# Altium schematic sheet Buck_60W20V_Overview.SchDoc
size A4; SheetNumber: 1; SheetTotal: 7
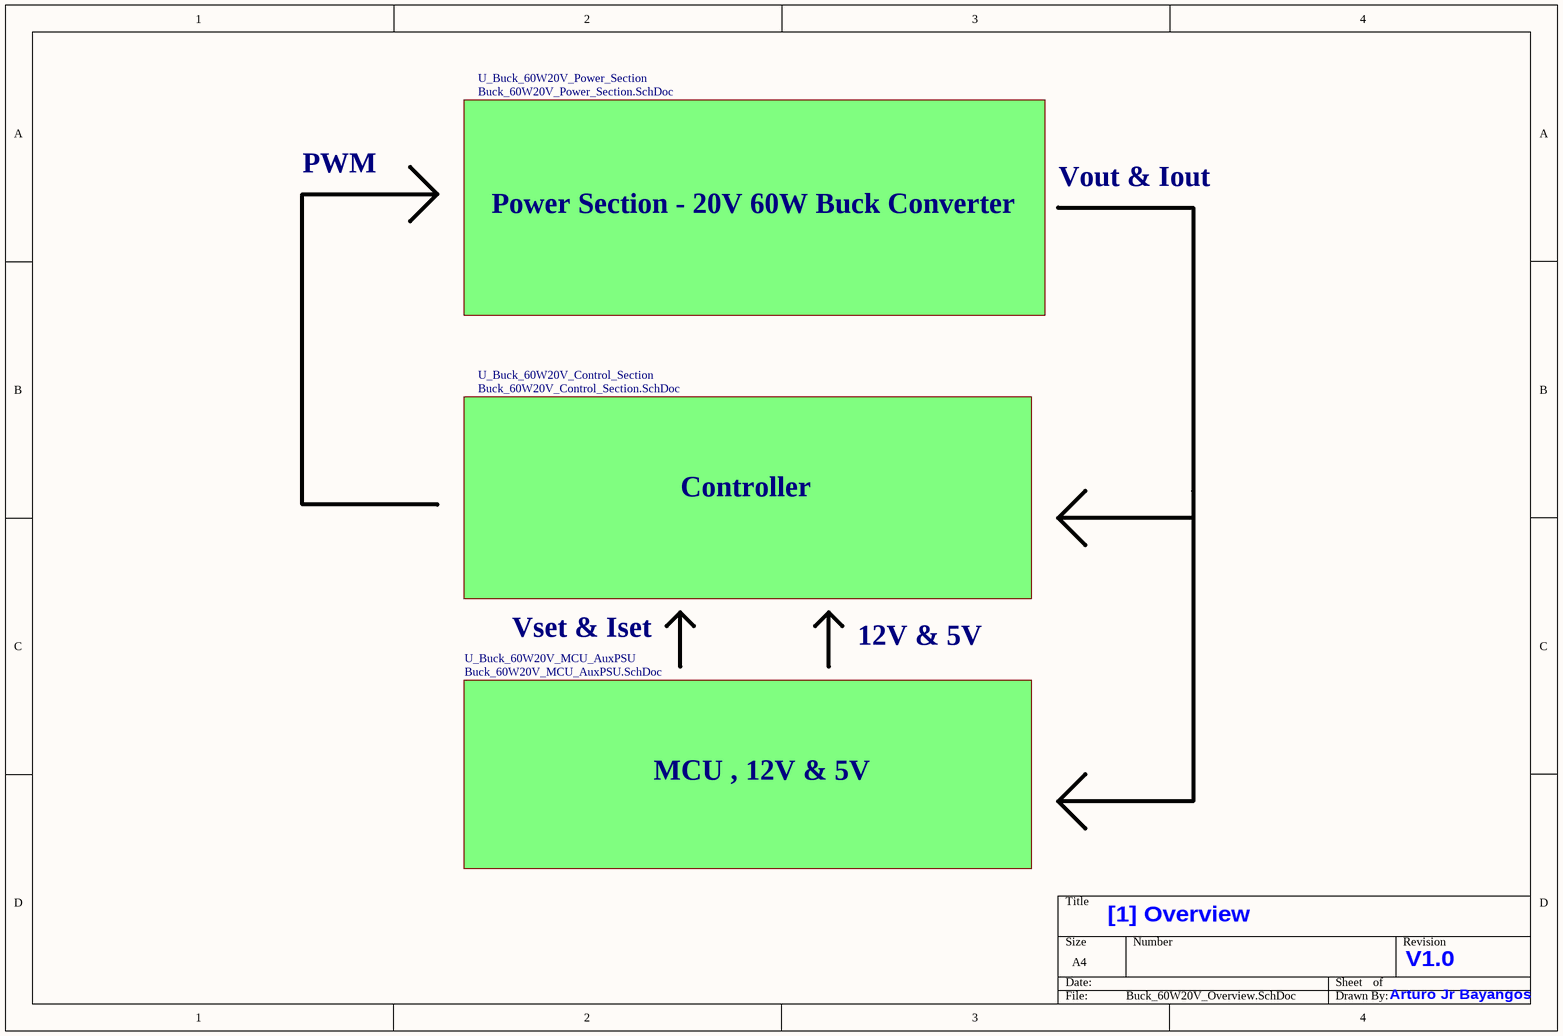
[diagram p0: Buck_60W20V_Overview.SchDoc]

## Sub-sheets
U_Buck_60W20V_Control_Section = Buck_60W20V_Control_Section.SchDoc: no entries  | Name: Controller
U_Buck_60W20V_MCU_AuxPSU = Buck_60W20V_MCU_AuxPSU.SchDoc: no entries  | Name: MCU , 12V & 5V
U_Buck_60W20V_Power_Section = Buck_60W20V_Power_Section.SchDoc: no entries  | Name: Power Section - 20V 60W Buck Converter

## Notes on the sheet
- PWM
- Vout & Iout
- Vset & Iset
- 12V & 5V
- [1] Overview
- V1.0
- Arturo Jr Bayangos